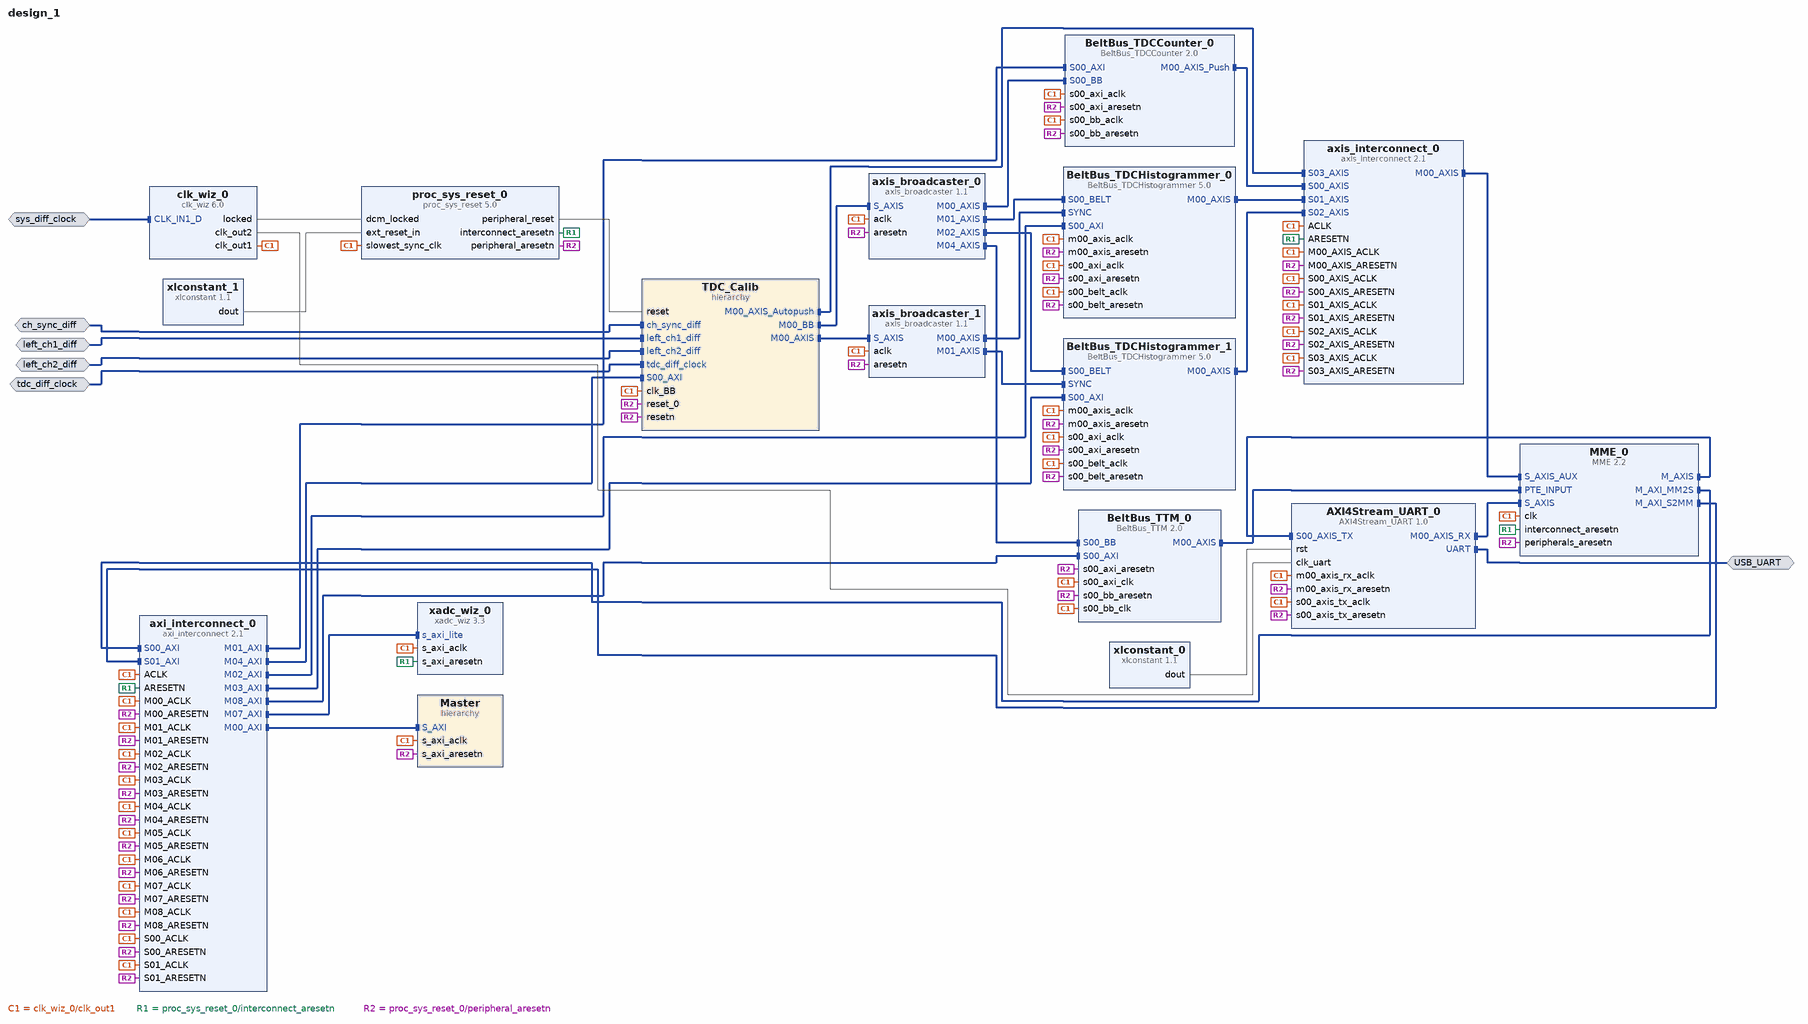
[diagram p0: block diagram of the top level]
# Vivado block design design_1, xc7k325tfbg676-2, Vivado 2020.2
create_bd_design design_1

create_bd_intf_port -mode Master -vlnv xilinx.com:interface:uart_rtl:1.0 USB_UART
create_bd_intf_port -mode Slave -vlnv DigiLAB:if:diff_ch_tdc_rtl:1.1 ch_sync_diff
create_bd_intf_port -mode Slave -vlnv DigiLAB:if:diff_ch_tdc_rtl:1.1 left_ch1_diff
create_bd_intf_port -mode Slave -vlnv DigiLAB:if:diff_ch_tdc_rtl:1.1 left_ch2_diff
create_bd_intf_port -mode Slave -vlnv xilinx.com:interface:diff_clock_rtl:1.0 sys_diff_clock
set_property -dict {CONFIG.FREQ_HZ 100000000} [get_bd_intf_ports sys_diff_clock]
create_bd_intf_port -mode Slave -vlnv xilinx.com:interface:diff_clock_rtl:1.0 tdc_diff_clock
set_property -dict {CONFIG.FREQ_HZ 156250000} [get_bd_intf_ports tdc_diff_clock]

create_bd_cell -type ip -vlnv TimeEngineers:ip:AXI4Stream_UART:1.0 AXI4Stream_UART_0
set_property -dict [list \
  CONFIG.UART_BAUD_RATE 2000000 \
  CONFIG.UART_BOARD_INTERFACE USB_UART \
  CONFIG.USE_BOARD_FLOW true \
] [get_bd_cells AXI4Stream_UART_0]
create_bd_cell -type ip -vlnv DigiLAB:ip:BeltBus_TDCCounter:2.0 BeltBus_TDCCounter_0
set_property -dict {CONFIG.NUM_CH 3} [get_bd_cells BeltBus_TDCCounter_0]
create_bd_cell -type ip -vlnv DigiLAB:ip:BeltBus_TDCHistogrammer:5.0 BeltBus_TDCHistogrammer_0
set_property -dict [list \
  CONFIG.BIN_ADDR_WIDTH 13 \
  CONFIG.BIN_DATA_WIDTH 27 \
  CONFIG.BIT_OVERFLOW 16 \
  CONFIG.NUM_CH 3 \
] [get_bd_cells BeltBus_TDCHistogrammer_0]
create_bd_cell -type ip -vlnv DigiLAB:ip:BeltBus_TDCHistogrammer:5.0 BeltBus_TDCHistogrammer_1
set_property -dict [list \
  CONFIG.BIN_ADDR_WIDTH 13 \
  CONFIG.BIN_DATA_WIDTH 27 \
  CONFIG.BIT_OVERFLOW 16 \
  CONFIG.NUM_CH 3 \
] [get_bd_cells BeltBus_TDCHistogrammer_1]
create_bd_cell -type ip -vlnv DigiLAB:ip:BeltBus_TTM:2.0 BeltBus_TTM_0
set_property -dict [list \
  CONFIG.CUSTOM_TRESHOLD false \
  CONFIG.INS_TIMEOUT_CYCLES 100000000 \
  CONFIG.TAIL_FIFO_DEPTH 16384 \
  CONFIG.TLAST_GEN_TIMEOUT_CYCLES 30 \
] [get_bd_cells BeltBus_TTM_0]
create_bd_cell -type ip -vlnv DigiLAB:hier:MME:2.2 MME_0
set_property -dict {CONFIG.MAX_PACKET_LENGTH_PACKETIZER 131072 CONFIG.PTE_AUXILIARY_PORTS true} [get_bd_cells MME_0]
create_bd_cell -type hier Master
create_bd_cell -type hier TDC_Calib
create_bd_cell -type ip -vlnv xilinx.com:ip:axi_interconnect:2.1 axi_interconnect_0
set_property -dict {CONFIG.NUM_MI 9 CONFIG.NUM_SI 2} [get_bd_cells axi_interconnect_0]
create_bd_cell -type ip -vlnv xilinx.com:ip:axis_broadcaster:1.1 axis_broadcaster_0
set_property -dict [list \
  CONFIG.HAS_TREADY 0 \
  CONFIG.M00_TDATA_REMAP {tdata[31:0]} \
  CONFIG.M01_TDATA_REMAP {tdata[31:0]} \
  CONFIG.M02_TDATA_REMAP {tdata[31:0]} \
  CONFIG.M03_TDATA_REMAP {tdata[31:0]} \
  CONFIG.M04_TDATA_REMAP {tdata[31:0]} \
  CONFIG.M_TDATA_NUM_BYTES 4 \
  CONFIG.NUM_MI 5 \
  CONFIG.S_TDATA_NUM_BYTES 4 \
] [get_bd_cells axis_broadcaster_0]
create_bd_cell -type ip -vlnv xilinx.com:ip:axis_broadcaster:1.1 axis_broadcaster_1
set_property -dict [list \
  CONFIG.HAS_TREADY 0 \
  CONFIG.M00_TDATA_REMAP {tdata[39:0]} \
  CONFIG.M01_TDATA_REMAP {tdata[39:0]} \
  CONFIG.M02_TDATA_REMAP {tdata[31:0]} \
  CONFIG.M03_TDATA_REMAP {tdata[31:0]} \
  CONFIG.M_TDATA_NUM_BYTES 5 \
  CONFIG.NUM_MI 2 \
  CONFIG.S_TDATA_NUM_BYTES 5 \
] [get_bd_cells axis_broadcaster_1]
create_bd_cell -type ip -vlnv xilinx.com:ip:axis_interconnect:2.1 axis_interconnect_0
set_property -dict {CONFIG.NUM_MI 1 CONFIG.NUM_SI 4} [get_bd_cells axis_interconnect_0]
create_bd_cell -type ip -vlnv xilinx.com:ip:clk_wiz:6.0 clk_wiz_0
set_property -dict [list \
  CONFIG.CLKOUT1_JITTER 144.719 \
  CONFIG.CLKOUT1_PHASE_ERROR 114.212 \
  CONFIG.CLKOUT2_JITTER 131.841 \
  CONFIG.CLKOUT2_PHASE_ERROR 114.212 \
  CONFIG.CLKOUT2_REQUESTED_OUT_FREQ 160.000 \
  CONFIG.CLKOUT2_USED true \
  CONFIG.CLK_IN1_BOARD_INTERFACE sys_diff_clock \
  CONFIG.MMCM_CLKFBOUT_MULT_F 8.000 \
  CONFIG.MMCM_CLKOUT0_DIVIDE_F 8.000 \
  CONFIG.MMCM_CLKOUT1_DIVIDE 5 \
  CONFIG.NUM_OUT_CLKS 2 \
  CONFIG.USE_BOARD_FLOW true \
  CONFIG.USE_RESET false \
] [get_bd_cells clk_wiz_0]
create_bd_cell -type ip -vlnv xilinx.com:ip:proc_sys_reset:5.0 proc_sys_reset_0
create_bd_cell -type ip -vlnv xilinx.com:ip:xadc_wiz:3.3 xadc_wiz_0
set_property -dict [list \
  CONFIG.ADC_CONVERSION_RATE 39 \
  CONFIG.CHANNEL_AVERAGING 256 \
  CONFIG.CHANNEL_ENABLE_TEMPERATURE true \
  CONFIG.CHANNEL_ENABLE_VP_VN false \
  CONFIG.DCLK_FREQUENCY 8 \
  CONFIG.EXTERNAL_MUX_CHANNEL VP_VN \
  CONFIG.OT_ALARM false \
  CONFIG.SEQUENCER_MODE Continuous \
  CONFIG.SINGLE_CHANNEL_SELECTION TEMPERATURE \
  CONFIG.USER_TEMP_ALARM false \
  CONFIG.VCCAUX_ALARM false \
  CONFIG.VCCINT_ALARM false \
  CONFIG.XADC_STARUP_SELECTION channel_sequencer \
] [get_bd_cells xadc_wiz_0]
create_bd_cell -type ip -vlnv xilinx.com:ip:xlconstant:1.1 xlconstant_0
set_property -dict {CONFIG.CONST_VAL 0} [get_bd_cells xlconstant_0]
create_bd_cell -type ip -vlnv xilinx.com:ip:xlconstant:1.1 xlconstant_1
set_property -dict {CONFIG.CONST_VAL 1} [get_bd_cells xlconstant_1]

# ---- hierarchy /Master ----
current_bd_instance /Master
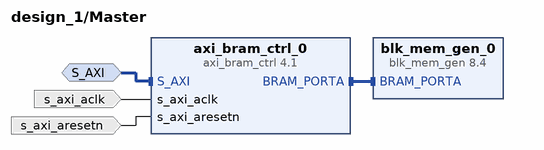
[diagram p1: block diagram inside /Master]
create_bd_intf_pin -mode Slave -vlnv xilinx.com:interface:aximm_rtl:1.0 S_AXI
create_bd_pin -dir I -type clk s_axi_aclk
create_bd_pin -dir I -type rst s_axi_aresetn

create_bd_cell -type ip -vlnv xilinx.com:ip:axi_bram_ctrl:4.1 axi_bram_ctrl_0
set_property -dict {CONFIG.SINGLE_PORT_BRAM 1 CONFIG.SUPPORTS_NARROW_BURST 0} [get_bd_cells axi_bram_ctrl_0]
create_bd_cell -type ip -vlnv xilinx.com:ip:blk_mem_gen:8.4 blk_mem_gen_0
set_property -dict [list \
  CONFIG.Coe_File ../../../../../../../../../master_v70.coe \
  CONFIG.EN_SAFETY_CKT true \
  CONFIG.Enable_32bit_Address true \
  CONFIG.Load_Init_File true \
  CONFIG.Memory_Type Single_Port_ROM \
  CONFIG.Port_A_Write_Rate 0 \
  CONFIG.Register_PortA_Output_of_Memory_Primitives false \
  CONFIG.Use_RSTA_Pin true \
  CONFIG.use_bram_block BRAM_Controller \
] [get_bd_cells blk_mem_gen_0]

# ---- hierarchy /TDC_Calib ----
current_bd_instance /TDC_Calib
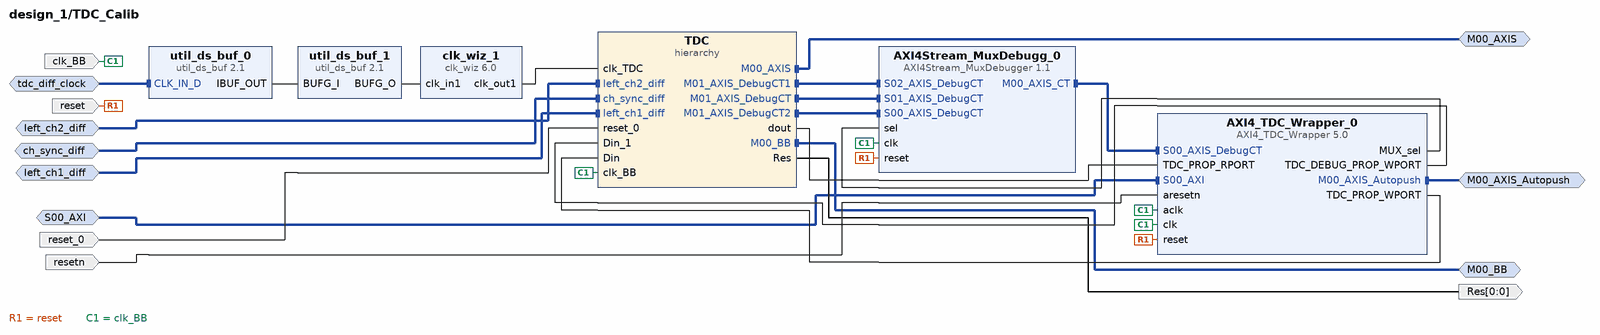
[diagram p2: block diagram inside /TDC_Calib]
create_bd_intf_pin -mode Master -vlnv xilinx.com:interface:axis_rtl:1.0 M00_AXIS
create_bd_intf_pin -mode Master -vlnv xilinx.com:interface:axis_rtl:1.0 M00_AXIS_Autopush
create_bd_intf_pin -mode Master -vlnv xilinx.com:interface:axis_rtl:1.0 M00_BB
create_bd_intf_pin -mode Slave -vlnv xilinx.com:interface:aximm_rtl:1.0 S00_AXI
create_bd_intf_pin -mode Slave -vlnv DigiLAB:if:diff_ch_tdc_rtl:1.1 ch_sync_diff
create_bd_intf_pin -mode Slave -vlnv DigiLAB:if:diff_ch_tdc_rtl:1.1 left_ch1_diff
create_bd_intf_pin -mode Slave -vlnv DigiLAB:if:diff_ch_tdc_rtl:1.1 left_ch2_diff
create_bd_intf_pin -mode Slave -vlnv xilinx.com:interface:diff_clock_rtl:1.0 tdc_diff_clock
create_bd_pin -dir O -from 0 -to 0 Res
create_bd_pin -dir I -type clk clk_BB
create_bd_pin -dir I -type rst reset
create_bd_pin -dir I -type rst reset_0
create_bd_pin -dir I -type rst resetn

create_bd_cell -type ip -vlnv DigiLAB:ip:AXI4Stream_MuxDebugger:1.1 AXI4Stream_MuxDebugg_0
set_property -dict {CONFIG.DEBUG_MODE_CC false CONFIG.NUM_CHANNEL 3} [get_bd_cells AXI4Stream_MuxDebugg_0]
create_bd_cell -type ip -vlnv DigiLAB:ip:AXI4_TDC_Wrapper:5.0 AXI4_TDC_Wrapper_0
set_property -dict [list \
  CONFIG.BIT_CALIBRATION 24 \
  CONFIG.BIT_RESOLUTION 11 \
  CONFIG.BIT_UNCALIBRATED 11 \
  CONFIG.C_S00_AXI_ADDR_ABS 0x44A40000 \
  CONFIG.DEBUG_MODE_CC false \
  CONFIG.DEF_CH_STRETCHERLENGTH 6 \
  CONFIG.DEF_SYNC_STRETCHERLENGTH 1 \
  CONFIG.PW_StretcherLength 3 \
  CONFIG.TDC_CH_RPORT_WIDTH 65 \
  CONFIG.TDC_ENABLE_DEBUG_PORTS true \
] [get_bd_cells AXI4_TDC_Wrapper_0]
create_bd_cell -type hier TDC
create_bd_cell -type ip -vlnv xilinx.com:ip:clk_wiz:6.0 clk_wiz_1
set_property -dict [list \
  CONFIG.CLKIN1_JITTER_PS 64.0 \
  CONFIG.CLKOUT1_JITTER 119.965 \
  CONFIG.CLKOUT1_PHASE_ERROR 158.075 \
  CONFIG.CLKOUT1_REQUESTED_OUT_FREQ 416.66667 \
  CONFIG.MMCM_CLKFBOUT_MULT_F 19.000 \
  CONFIG.MMCM_CLKIN1_PERIOD 6.400 \
  CONFIG.MMCM_CLKIN2_PERIOD 10.000 \
  CONFIG.MMCM_CLKOUT0_DIVIDE_F 2.375 \
  CONFIG.MMCM_DIVCLK_DIVIDE 3 \
  CONFIG.PRIM_IN_FREQ 156.25 \
  CONFIG.USE_RESET false \
] [get_bd_cells clk_wiz_1]
create_bd_cell -type ip -vlnv xilinx.com:ip:util_ds_buf:2.1 util_ds_buf_0
set_property -dict {CONFIG.DIFF_CLK_IN_BOARD_INTERFACE tdc_diff_clock} [get_bd_cells util_ds_buf_0]
create_bd_cell -type ip -vlnv xilinx.com:ip:util_ds_buf:2.1 util_ds_buf_1
set_property -dict {CONFIG.C_BUF_TYPE BUFG CONFIG.DIFF_CLK_IN_BOARD_INTERFACE Custom} [get_bd_cells util_ds_buf_1]

# ---- hierarchy /TDC_Calib/TDC ----
current_bd_instance /TDC_Calib/TDC
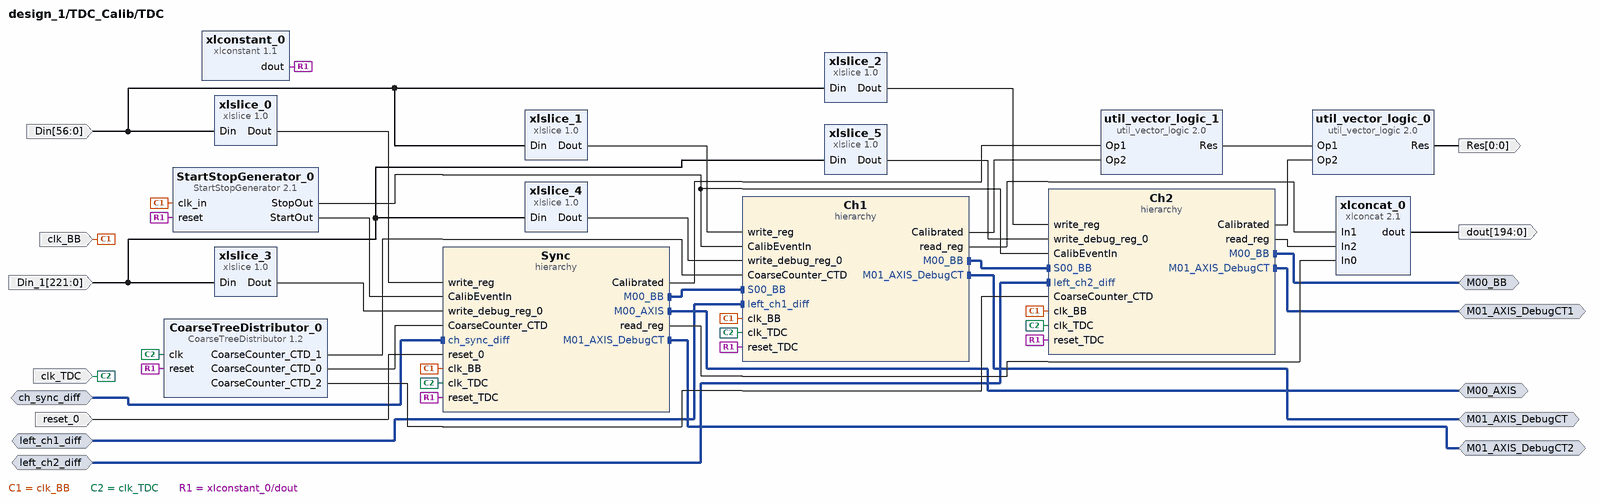
[diagram p3: block diagram inside /TDC_Calib/TDC]
create_bd_intf_pin -mode Master -vlnv xilinx.com:interface:axis_rtl:1.0 M00_AXIS
create_bd_intf_pin -mode Master -vlnv xilinx.com:interface:axis_rtl:1.0 M00_BB
create_bd_intf_pin -mode Master -vlnv xilinx.com:interface:axis_rtl:1.0 M01_AXIS_DebugCT
create_bd_intf_pin -mode Master -vlnv xilinx.com:interface:axis_rtl:1.0 M01_AXIS_DebugCT1
create_bd_intf_pin -mode Master -vlnv xilinx.com:interface:axis_rtl:1.0 M01_AXIS_DebugCT2
create_bd_intf_pin -mode Slave -vlnv DigiLAB:if:diff_ch_tdc_rtl:1.1 ch_sync_diff
create_bd_intf_pin -mode Slave -vlnv DigiLAB:if:diff_ch_tdc_rtl:1.1 left_ch1_diff
create_bd_intf_pin -mode Slave -vlnv DigiLAB:if:diff_ch_tdc_rtl:1.1 left_ch2_diff
create_bd_pin -dir I -from 56 -to 0 Din
create_bd_pin -dir I -from 221 -to 0 Din_1
create_bd_pin -dir O -from 0 -to 0 Res
create_bd_pin -dir I -type clk clk_BB
create_bd_pin -dir I -type clk clk_TDC
create_bd_pin -dir O -from 194 -to 0 dout
create_bd_pin -dir I -type rst reset_0

create_bd_cell -type hier Ch1
create_bd_cell -type hier Ch2
create_bd_cell -type ip -vlnv DigiLAB:ip:CoarseTreeDistributor:1.2 CoarseTreeDistributor_0
set_property -dict {CONFIG.NUMBER_OF_OUTPUT 3} [get_bd_cells CoarseTreeDistributor_0]
create_bd_cell -type ip -vlnv DigiLAB:ip:StartStopGenerator:2.1 StartStopGenerator_0
set_property -dict {CONFIG.CLK_SELECT EXTERNAL CONFIG.HALF_DIVIDER 5 CONFIG.TUNING_MODE false} [get_bd_cells StartStopGenerator_0]
create_bd_cell -type hier Sync
create_bd_cell -type ip -vlnv xilinx.com:ip:util_vector_logic:2.0 util_vector_logic_0
set_property -dict {CONFIG.C_SIZE 1} [get_bd_cells util_vector_logic_0]
create_bd_cell -type ip -vlnv xilinx.com:ip:util_vector_logic:2.0 util_vector_logic_1
set_property -dict {CONFIG.C_SIZE 1} [get_bd_cells util_vector_logic_1]
create_bd_cell -type ip -vlnv xilinx.com:ip:xlconcat:2.1 xlconcat_0
set_property -dict {CONFIG.IN0_WIDTH 65 CONFIG.IN1_WIDTH 65 CONFIG.IN2_WIDTH 65 CONFIG.NUM_PORTS 3} [get_bd_cells xlconcat_0]
create_bd_cell -type ip -vlnv xilinx.com:ip:xlconstant:1.1 xlconstant_0
set_property -dict {CONFIG.CONST_VAL 0} [get_bd_cells xlconstant_0]
create_bd_cell -type ip -vlnv xilinx.com:ip:xlslice:1.0 xlslice_0
set_property -dict {CONFIG.DIN_FROM 18 CONFIG.DIN_WIDTH 57 CONFIG.DOUT_WIDTH 19} [get_bd_cells xlslice_0]
create_bd_cell -type ip -vlnv xilinx.com:ip:xlslice:1.0 xlslice_1
set_property -dict {CONFIG.DIN_FROM 37 CONFIG.DIN_TO 19 CONFIG.DIN_WIDTH 57 CONFIG.DOUT_WIDTH 19} [get_bd_cells xlslice_1]
create_bd_cell -type ip -vlnv xilinx.com:ip:xlslice:1.0 xlslice_2
set_property -dict {CONFIG.DIN_FROM 56 CONFIG.DIN_TO 38 CONFIG.DIN_WIDTH 57 CONFIG.DOUT_WIDTH 19} [get_bd_cells xlslice_2]
create_bd_cell -type ip -vlnv xilinx.com:ip:xlslice:1.0 xlslice_3
set_property -dict {CONFIG.DIN_FROM 73 CONFIG.DIN_WIDTH 222 CONFIG.DOUT_WIDTH 74} [get_bd_cells xlslice_3]
create_bd_cell -type ip -vlnv xilinx.com:ip:xlslice:1.0 xlslice_4
set_property -dict {CONFIG.DIN_FROM 147 CONFIG.DIN_TO 74 CONFIG.DIN_WIDTH 222 CONFIG.DOUT_WIDTH 74} [get_bd_cells xlslice_4]
create_bd_cell -type ip -vlnv xilinx.com:ip:xlslice:1.0 xlslice_5
set_property -dict {CONFIG.DIN_FROM 221 CONFIG.DIN_TO 148 CONFIG.DIN_WIDTH 222 CONFIG.DOUT_WIDTH 74} [get_bd_cells xlslice_5]

# ---- hierarchy /TDC_Calib/TDC/Ch1 ----
current_bd_instance /TDC_Calib/TDC/Ch1
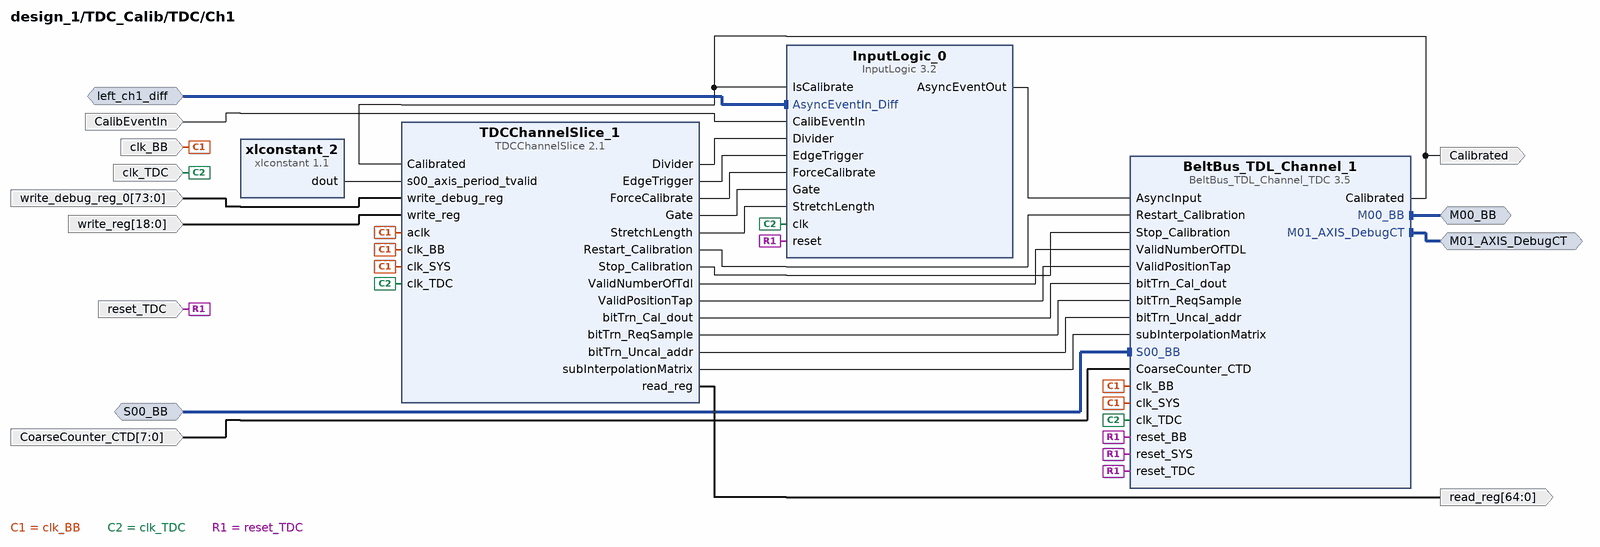
[diagram p4: block diagram inside /TDC_Calib/TDC/Ch1]
create_bd_intf_pin -mode Master -vlnv xilinx.com:interface:axis_rtl:1.0 M00_BB
create_bd_intf_pin -mode Master -vlnv xilinx.com:interface:axis_rtl:1.0 M01_AXIS_DebugCT
create_bd_intf_pin -mode Slave -vlnv xilinx.com:interface:axis_rtl:1.0 S00_BB
create_bd_intf_pin -mode Slave -vlnv DigiLAB:if:diff_ch_tdc_rtl:1.1 left_ch1_diff
create_bd_pin -dir I -type data CalibEventIn
create_bd_pin -dir O -type data Calibrated
create_bd_pin -dir I -from 7 -to 0 CoarseCounter_CTD
create_bd_pin -dir I -type clk clk_BB
create_bd_pin -dir I -type clk clk_TDC
create_bd_pin -dir O -from 64 -to 0 -type data read_reg
create_bd_pin -dir I -type rst reset_TDC
create_bd_pin -dir I -from 73 -to 0 -type data write_debug_reg_0
create_bd_pin -dir I -from 18 -to 0 -type data write_reg

create_bd_cell -type ip -vlnv DigiLAB:hier:BeltBus_TDL_Channel_TDC:3.5 BeltBus_TDL_Channel_1
set_property -dict [list \
  CONFIG.BIT_SMP_PRE_TDL 128 \
  CONFIG.BIT_SMP_TDL 512 \
  CONFIG.BIT_UNCALIBRATED 11 \
  CONFIG.BUFFERING_STAGE false \
  CONFIG.CEC_VS_CTD_COUNTER CTD \
  CONFIG.DEBUG_MODE true \
  CONFIG.DEBUG_MODE_CT true \
  CONFIG.DEBUG_PORT_DECODER true \
  CONFIG.MAX_VALID_TAP_POS 511 \
  CONFIG.MIN_VALID_TAP_POS -128 \
  CONFIG.NUMBER_OF_TDL 4 \
  CONFIG.NUM_CH 1 \
  CONFIG.NUM_NODE 1 \
  CONFIG.NUM_TAP_PRE_TDL 128 \
  CONFIG.NUM_TAP_TDL 512 \
  CONFIG.STEP_VALID_TAP_POS 16 \
  CONFIG.VALID_POSITION_TAP_INIT 0 \
] [get_bd_cells BeltBus_TDL_Channel_1]
create_bd_cell -type ip -vlnv DigiLAB:ip:InputLogic:3.2 InputLogic_0
set_property -dict [list \
  CONFIG.BIT_DIVIDER 4 \
  CONFIG.BIT_STRETCH_LENGTH 3 \
  CONFIG.INPUT_DIFF_CH_TDC_BOARD_INTERFACE left_ch1_diff \
  CONFIG.STRETCH_LENGTH_INIT 6 \
  CONFIG.TUNING_MODE true \
] [get_bd_cells InputLogic_0]
create_bd_cell -type ip -vlnv DigiLAB:ip:TDCChannelSlice:2.1 TDCChannelSlice_1
set_property -dict {CONFIG.BIT_DIVIDER 4 CONFIG.TDC_ENABLE_DEBUG_PORTS true} [get_bd_cells TDCChannelSlice_1]
create_bd_cell -type ip -vlnv xilinx.com:ip:xlconstant:1.1 xlconstant_2
set_property -dict {CONFIG.CONST_VAL 0} [get_bd_cells xlconstant_2]

# ---- hierarchy /TDC_Calib/TDC/Ch2 ----
current_bd_instance /TDC_Calib/TDC/Ch2
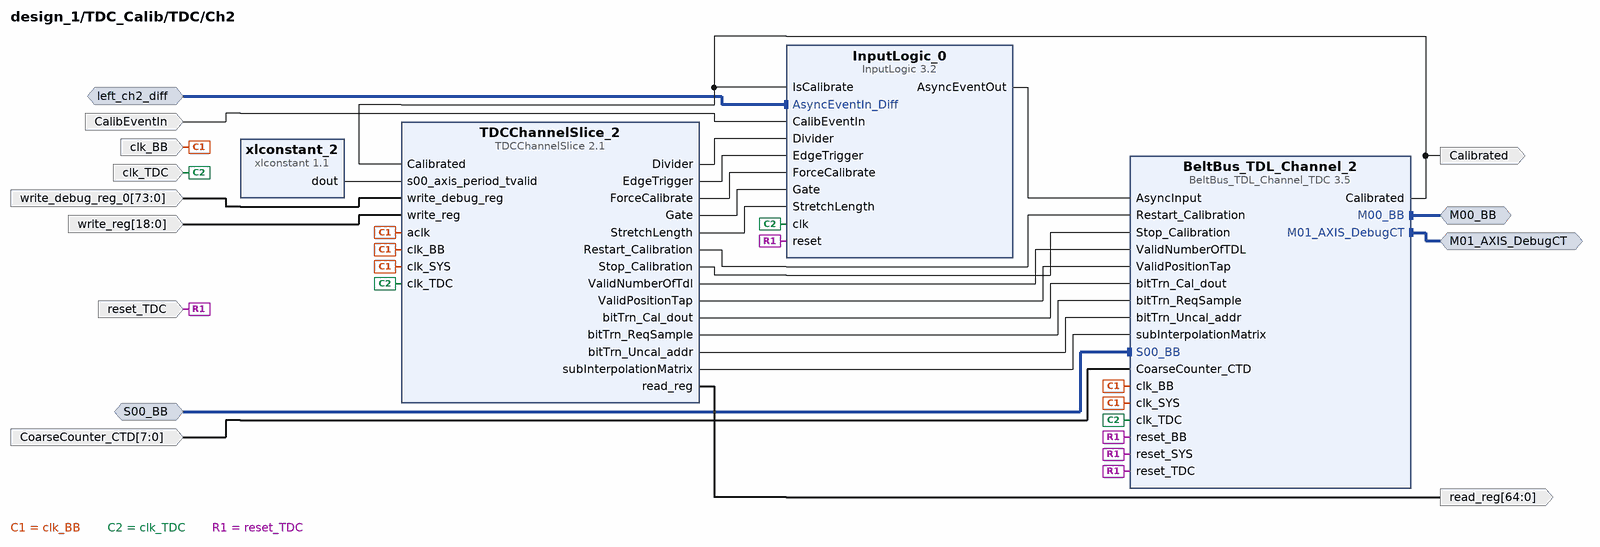
[diagram p5: block diagram inside /TDC_Calib/TDC/Ch2]
create_bd_intf_pin -mode Master -vlnv xilinx.com:interface:axis_rtl:1.0 M00_BB
create_bd_intf_pin -mode Master -vlnv xilinx.com:interface:axis_rtl:1.0 M01_AXIS_DebugCT
create_bd_intf_pin -mode Slave -vlnv xilinx.com:interface:axis_rtl:1.0 S00_BB
create_bd_intf_pin -mode Slave -vlnv DigiLAB:if:diff_ch_tdc_rtl:1.1 left_ch2_diff
create_bd_pin -dir I -type data CalibEventIn
create_bd_pin -dir O -type data Calibrated
create_bd_pin -dir I -from 7 -to 0 CoarseCounter_CTD
create_bd_pin -dir I -type clk clk_BB
create_bd_pin -dir I -type clk clk_TDC
create_bd_pin -dir O -from 64 -to 0 -type data read_reg
create_bd_pin -dir I -type rst reset_TDC
create_bd_pin -dir I -from 73 -to 0 -type data write_debug_reg_0
create_bd_pin -dir I -from 18 -to 0 -type data write_reg

create_bd_cell -type ip -vlnv DigiLAB:hier:BeltBus_TDL_Channel_TDC:3.5 BeltBus_TDL_Channel_2
set_property -dict [list \
  CONFIG.BIT_SMP_PRE_TDL 128 \
  CONFIG.BIT_SMP_TDL 512 \
  CONFIG.BIT_UNCALIBRATED 11 \
  CONFIG.BUFFERING_STAGE false \
  CONFIG.CEC_VS_CTD_COUNTER CTD \
  CONFIG.DEBUG_MODE true \
  CONFIG.DEBUG_MODE_CT true \
  CONFIG.DEBUG_PORT_DECODER true \
  CONFIG.MAX_VALID_TAP_POS 511 \
  CONFIG.MIN_VALID_TAP_POS -128 \
  CONFIG.NUMBER_OF_TDL 4 \
  CONFIG.NUM_CH 2 \
  CONFIG.NUM_NODE 2 \
  CONFIG.NUM_TAP_PRE_TDL 128 \
  CONFIG.NUM_TAP_TDL 512 \
  CONFIG.STEP_VALID_TAP_POS 16 \
  CONFIG.VALID_POSITION_TAP_INIT 0 \
] [get_bd_cells BeltBus_TDL_Channel_2]
create_bd_cell -type ip -vlnv DigiLAB:ip:InputLogic:3.2 InputLogic_0
set_property -dict [list \
  CONFIG.BIT_DIVIDER 4 \
  CONFIG.BIT_STRETCH_LENGTH 3 \
  CONFIG.INPUT_DIFF_CH_TDC_BOARD_INTERFACE left_ch2_diff \
  CONFIG.INVERT_BUFFER_POLARITY true \
  CONFIG.STRETCH_LENGTH_INIT 6 \
  CONFIG.TUNING_MODE true \
] [get_bd_cells InputLogic_0]
create_bd_cell -type ip -vlnv DigiLAB:ip:TDCChannelSlice:2.1 TDCChannelSlice_2
set_property -dict {CONFIG.BIT_DIVIDER 4 CONFIG.TDC_ENABLE_DEBUG_PORTS true} [get_bd_cells TDCChannelSlice_2]
create_bd_cell -type ip -vlnv xilinx.com:ip:xlconstant:1.1 xlconstant_2
set_property -dict {CONFIG.CONST_VAL 0} [get_bd_cells xlconstant_2]

# ---- hierarchy /TDC_Calib/TDC/Sync ----
current_bd_instance /TDC_Calib/TDC/Sync
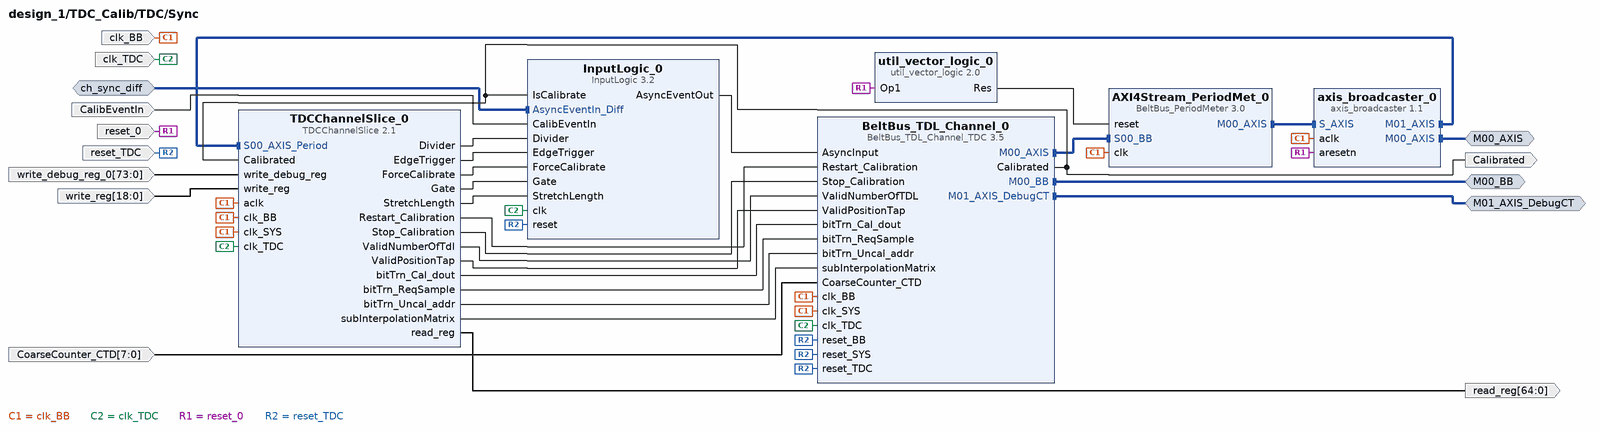
[diagram p6: block diagram inside /TDC_Calib/TDC/Sync]
create_bd_intf_pin -mode Master -vlnv xilinx.com:interface:axis_rtl:1.0 M00_AXIS
create_bd_intf_pin -mode Master -vlnv xilinx.com:interface:axis_rtl:1.0 M00_BB
create_bd_intf_pin -mode Master -vlnv xilinx.com:interface:axis_rtl:1.0 M01_AXIS_DebugCT
create_bd_intf_pin -mode Slave -vlnv DigiLAB:if:diff_ch_tdc_rtl:1.1 ch_sync_diff
create_bd_pin -dir I -type data CalibEventIn
create_bd_pin -dir O -type data Calibrated
create_bd_pin -dir I -from 7 -to 0 CoarseCounter_CTD
create_bd_pin -dir I -type clk clk_BB
create_bd_pin -dir I -type clk clk_TDC
create_bd_pin -dir O -from 64 -to 0 -type data read_reg
create_bd_pin -dir I -type rst reset_0
create_bd_pin -dir I -type rst reset_TDC
create_bd_pin -dir I -from 73 -to 0 -type data write_debug_reg_0
create_bd_pin -dir I -from 18 -to 0 -type data write_reg

create_bd_cell -type ip -vlnv DigiLAB:ip:BeltBus_PeriodMeter:3.0 AXI4Stream_PeriodMet_0
set_property -dict {CONFIG.BIT_COARSE 8 CONFIG.BIT_OVERFLOW 16} [get_bd_cells AXI4Stream_PeriodMet_0]
create_bd_cell -type ip -vlnv DigiLAB:hier:BeltBus_TDL_Channel_TDC:3.5 BeltBus_TDL_Channel_0
set_property -dict [list \
  CONFIG.BIT_SMP_PRE_TDL 128 \
  CONFIG.BIT_SMP_TDL 512 \
  CONFIG.BIT_UNCALIBRATED 11 \
  CONFIG.BUFFERING_STAGE false \
  CONFIG.CEC_VS_CTD_COUNTER CTD \
  CONFIG.DEBUG_MODE true \
  CONFIG.DEBUG_MODE_CT true \
  CONFIG.DEBUG_PORT_DECODER true \
  CONFIG.MAX_VALID_TAP_POS 511 \
  CONFIG.MIN_VALID_TAP_POS -128 \
  CONFIG.NUMBER_OF_TDL 4 \
  CONFIG.NUM_TAP_PRE_TDL 128 \
  CONFIG.NUM_TAP_TDL 512 \
  CONFIG.PASS_THROUGH Both \
  CONFIG.STEP_VALID_TAP_POS 16 \
  CONFIG.VALID_POSITION_TAP_INIT 0 \
] [get_bd_cells BeltBus_TDL_Channel_0]
create_bd_cell -type ip -vlnv DigiLAB:ip:InputLogic:3.2 InputLogic_0
set_property -dict [list \
  CONFIG.BIT_DIVIDER 4 \
  CONFIG.BIT_STRETCH_LENGTH 3 \
  CONFIG.DIVIDER_INIT 15 \
  CONFIG.INPUT_DIFF_CH_TDC_BOARD_INTERFACE ch_sync_diff \
  CONFIG.STRETCH_LENGTH_INIT 6 \
  CONFIG.TUNING_MODE true \
] [get_bd_cells InputLogic_0]
create_bd_cell -type ip -vlnv DigiLAB:ip:TDCChannelSlice:2.1 TDCChannelSlice_0
set_property -dict [list \
  CONFIG.BIT_DIVIDER 4 \
  CONFIG.BIT_OVERFLOW 16 \
  CONFIG.TDC_ENABLE_DEBUG_PORTS true \
] [get_bd_cells TDCChannelSlice_0]
create_bd_cell -type ip -vlnv xilinx.com:ip:axis_broadcaster:1.1 axis_broadcaster_0
set_property -dict [list \
  CONFIG.HAS_TREADY 0 \
  CONFIG.M00_TDATA_REMAP {tdata[39:0]} \
  CONFIG.M01_TDATA_REMAP {tdata[39:0]} \
  CONFIG.M_TDATA_NUM_BYTES 5 \
  CONFIG.S_TDATA_NUM_BYTES 5 \
] [get_bd_cells axis_broadcaster_0]
create_bd_cell -type ip -vlnv xilinx.com:ip:util_vector_logic:2.0 util_vector_logic_0
set_property -dict {CONFIG.C_OPERATION not CONFIG.C_SIZE 1} [get_bd_cells util_vector_logic_0]

# ---- connections ----

current_bd_instance /Master
connect_bd_intf_net -intf_net axi_interconnect_0_M00_AXI [get_bd_intf_pins S_AXI] [get_bd_intf_pins axi_bram_ctrl_0/S_AXI]
connect_bd_intf_net [get_bd_intf_pins axi_bram_ctrl_0/BRAM_PORTA] [get_bd_intf_pins blk_mem_gen_0/BRAM_PORTA]
connect_bd_net [get_bd_pins s_axi_aclk] [get_bd_pins axi_bram_ctrl_0/s_axi_aclk]
connect_bd_net [get_bd_pins s_axi_aresetn] [get_bd_pins axi_bram_ctrl_0/s_axi_aresetn]

current_bd_instance /TDC_Calib
connect_bd_intf_net [get_bd_intf_pins left_ch2_diff] [get_bd_intf_pins TDC/left_ch2_diff]
connect_bd_intf_net [get_bd_intf_pins M00_AXIS] [get_bd_intf_pins TDC/M00_AXIS]
connect_bd_intf_net [get_bd_intf_pins AXI4Stream_MuxDebugg_0/S02_AXIS_DebugCT] [get_bd_intf_pins TDC/M01_AXIS_DebugCT1]
connect_bd_intf_net [get_bd_intf_pins M00_BB] [get_bd_intf_pins TDC/M00_BB]
connect_bd_intf_net [get_bd_intf_pins AXI4Stream_MuxDebugg_0/S01_AXIS_DebugCT] [get_bd_intf_pins TDC/M01_AXIS_DebugCT]
connect_bd_intf_net [get_bd_intf_pins ch_sync_diff] [get_bd_intf_pins TDC/ch_sync_diff]
connect_bd_intf_net [get_bd_intf_pins M00_AXIS_Autopush] [get_bd_intf_pins AXI4_TDC_Wrapper_0/M00_AXIS_Autopush]
connect_bd_intf_net [get_bd_intf_pins AXI4Stream_MuxDebugg_0/S00_AXIS_DebugCT] [get_bd_intf_pins TDC/M01_AXIS_DebugCT2]
connect_bd_intf_net [get_bd_intf_pins AXI4Stream_MuxDebugg_0/M00_AXIS_CT] [get_bd_intf_pins AXI4_TDC_Wrapper_0/S00_AXIS_DebugCT]
connect_bd_intf_net [get_bd_intf_pins left_ch1_diff] [get_bd_intf_pins TDC/left_ch1_diff]
connect_bd_intf_net [get_bd_intf_pins tdc_diff_clock] [get_bd_intf_pins util_ds_buf_0/CLK_IN_D]
connect_bd_intf_net [get_bd_intf_pins S00_AXI] [get_bd_intf_pins AXI4_TDC_Wrapper_0/S00_AXI]
connect_bd_net [get_bd_pins AXI4_TDC_Wrapper_0/MUX_sel] [get_bd_pins AXI4Stream_MuxDebugg_0/sel]
connect_bd_net [get_bd_pins AXI4_TDC_Wrapper_0/TDC_DEBUG_PROP_WPORT] [get_bd_pins TDC/Din_1]
connect_bd_net [get_bd_pins AXI4_TDC_Wrapper_0/TDC_PROP_WPORT] [get_bd_pins TDC/Din]
connect_bd_net [get_bd_pins reset] [get_bd_pins AXI4Stream_MuxDebugg_0/reset] [get_bd_pins AXI4_TDC_Wrapper_0/reset]
connect_bd_net [get_bd_pins TDC/Res] [get_bd_pins Res]
connect_bd_net [get_bd_pins TDC/dout] [get_bd_pins AXI4_TDC_Wrapper_0/TDC_PROP_RPORT]
connect_bd_net -net clk_wiz_0_clk_out1 [get_bd_pins clk_BB] \
  [get_bd_pins AXI4Stream_MuxDebugg_0/clk] [get_bd_pins AXI4_TDC_Wrapper_0/aclk] [get_bd_pins AXI4_TDC_Wrapper_0/clk] \
  [get_bd_pins TDC/clk_BB]
connect_bd_net [get_bd_pins clk_wiz_1/clk_out1] [get_bd_pins TDC/clk_TDC]
connect_bd_net -net proc_sys_reset_0_peripheral_aresetn [get_bd_pins resetn] [get_bd_pins AXI4_TDC_Wrapper_0/aresetn]
connect_bd_net -net reset_0_1 [get_bd_pins reset_0] [get_bd_pins TDC/reset_0]
connect_bd_net [get_bd_pins util_ds_buf_0/IBUF_OUT] [get_bd_pins util_ds_buf_1/BUFG_I]
connect_bd_net [get_bd_pins util_ds_buf_1/BUFG_O] [get_bd_pins clk_wiz_1/clk_in1]

current_bd_instance /TDC_Calib/TDC
connect_bd_intf_net -intf_net BeltBus_TDL_Channel_2_M00_BB [get_bd_intf_pins M00_BB] [get_bd_intf_pins Ch2/M00_BB]
connect_bd_intf_net [get_bd_intf_pins ch_sync_diff] [get_bd_intf_pins Sync/ch_sync_diff]
connect_bd_intf_net -intf_net BeltBus_TDL_Channel_1_M00_BB [get_bd_intf_pins Ch1/M00_BB] [get_bd_intf_pins Ch2/S00_BB]
connect_bd_intf_net -intf_net BeltBus_TDL_Channel_1_M01_AXIS_DebugCT [get_bd_intf_pins M01_AXIS_DebugCT] [get_bd_intf_pins Ch1/M01_AXIS_DebugCT]
connect_bd_intf_net -intf_net BeltBus_TDL_Channel_2_M01_AXIS_DebugCT [get_bd_intf_pins M01_AXIS_DebugCT1] [get_bd_intf_pins Ch2/M01_AXIS_DebugCT]
connect_bd_intf_net [get_bd_intf_pins M00_AXIS] [get_bd_intf_pins Sync/M00_AXIS]
connect_bd_intf_net [get_bd_intf_pins left_ch1_diff] [get_bd_intf_pins Ch1/left_ch1_diff]
connect_bd_intf_net [get_bd_intf_pins left_ch2_diff] [get_bd_intf_pins Ch2/left_ch2_diff]
connect_bd_intf_net -intf_net BeltBus_TDL_Channel_0_M00_BB [get_bd_intf_pins Ch1/S00_BB] [get_bd_intf_pins Sync/M00_BB]
connect_bd_intf_net -intf_net BeltBus_TDL_Channel_0_M01_AXIS_DebugCT [get_bd_intf_pins M01_AXIS_DebugCT2] [get_bd_intf_pins Sync/M01_AXIS_DebugCT]
connect_bd_net -net BeltBus_TDL_Channel_TDC_0_Calibrated [get_bd_pins Sync/Calibrated] [get_bd_pins util_vector_logic_1/Op1]
connect_bd_net -net BeltBus_TDL_Channel_TDC_1_Calibrated [get_bd_pins Ch1/Calibrated] [get_bd_pins util_vector_logic_1/Op2]
connect_bd_net -net BeltBus_TDL_Channel_TDC_2_Calibrated [get_bd_pins Ch2/Calibrated] [get_bd_pins util_vector_logic_0/Op2]
connect_bd_net [get_bd_pins CoarseTreeDistributor_0/CoarseCounter_CTD_0] [get_bd_pins Sync/CoarseCounter_CTD]
connect_bd_net [get_bd_pins CoarseTreeDistributor_0/CoarseCounter_CTD_1] [get_bd_pins Ch1/CoarseCounter_CTD]
connect_bd_net [get_bd_pins CoarseTreeDistributor_0/CoarseCounter_CTD_2] [get_bd_pins Ch2/CoarseCounter_CTD]
connect_bd_net -net Din_1_1 [get_bd_pins Din_1] [get_bd_pins xlslice_3/Din] [get_bd_pins xlslice_4/Din] [get_bd_pins xlslice_5/Din]
connect_bd_net [get_bd_pins Din] [get_bd_pins xlslice_0/Din] [get_bd_pins xlslice_1/Din] [get_bd_pins xlslice_2/Din]
connect_bd_net [get_bd_pins StartStopGenerator_0/StartOut] [get_bd_pins Sync/CalibEventIn]
connect_bd_net [get_bd_pins StartStopGenerator_0/StopOut] [get_bd_pins Ch1/CalibEventIn] [get_bd_pins Ch2/CalibEventIn]
connect_bd_net [get_bd_pins Sync/read_reg] [get_bd_pins xlconcat_0/In0]
connect_bd_net -net TDCChannelSlice_1_read_reg [get_bd_pins Ch1/read_reg] [get_bd_pins xlconcat_0/In1]
connect_bd_net -net TDCChannelSlice_2_read_reg [get_bd_pins Ch2/read_reg] [get_bd_pins xlconcat_0/In2]
connect_bd_net [get_bd_pins clk_BB] \
  [get_bd_pins Ch1/clk_BB] [get_bd_pins Ch2/clk_BB] [get_bd_pins StartStopGenerator_0/clk_in] [get_bd_pins Sync/clk_BB]
connect_bd_net [get_bd_pins clk_TDC] \
  [get_bd_pins Ch1/clk_TDC] [get_bd_pins Ch2/clk_TDC] [get_bd_pins CoarseTreeDistributor_0/clk] [get_bd_pins Sync/clk_TDC]
connect_bd_net -net reset_0_1 [get_bd_pins reset_0] [get_bd_pins Sync/reset_0]
connect_bd_net -net reset_TDC_1 [get_bd_pins xlconstant_0/dout] \
  [get_bd_pins Ch1/reset_TDC] [get_bd_pins Ch2/reset_TDC] [get_bd_pins CoarseTreeDistributor_0/reset] \
  [get_bd_pins StartStopGenerator_0/reset] [get_bd_pins Sync/reset_TDC]
connect_bd_net [get_bd_pins util_vector_logic_0/Res] [get_bd_pins Res]
connect_bd_net [get_bd_pins util_vector_logic_1/Res] [get_bd_pins util_vector_logic_0/Op1]
connect_bd_net [get_bd_pins xlconcat_0/dout] [get_bd_pins dout]
connect_bd_net [get_bd_pins xlslice_0/Dout] [get_bd_pins Sync/write_reg]
connect_bd_net [get_bd_pins xlslice_1/Dout] [get_bd_pins Ch1/write_reg]
connect_bd_net [get_bd_pins xlslice_2/Dout] [get_bd_pins Ch2/write_reg]
connect_bd_net [get_bd_pins xlslice_3/Dout] [get_bd_pins Sync/write_debug_reg_0]
connect_bd_net [get_bd_pins xlslice_4/Dout] [get_bd_pins Ch1/write_debug_reg_0]
connect_bd_net [get_bd_pins xlslice_5/Dout] [get_bd_pins Ch2/write_debug_reg_0]

current_bd_instance /TDC_Calib/TDC/Ch1
connect_bd_intf_net [get_bd_intf_pins M00_BB] [get_bd_intf_pins BeltBus_TDL_Channel_1/M00_BB]
connect_bd_intf_net [get_bd_intf_pins left_ch1_diff] [get_bd_intf_pins InputLogic_0/AsyncEventIn_Diff]
connect_bd_intf_net [get_bd_intf_pins M01_AXIS_DebugCT] [get_bd_intf_pins BeltBus_TDL_Channel_1/M01_AXIS_DebugCT]
connect_bd_intf_net [get_bd_intf_pins S00_BB] [get_bd_intf_pins BeltBus_TDL_Channel_1/S00_BB]
connect_bd_net -net BeltBus_TDL_Channel_TDC_1_Calibrated [get_bd_pins BeltBus_TDL_Channel_1/Calibrated] \
  [get_bd_pins Calibrated] [get_bd_pins InputLogic_0/IsCalibrate] [get_bd_pins TDCChannelSlice_1/Calibrated]
connect_bd_net [get_bd_pins CalibEventIn] [get_bd_pins InputLogic_0/CalibEventIn]
connect_bd_net [get_bd_pins CoarseCounter_CTD] [get_bd_pins BeltBus_TDL_Channel_1/CoarseCounter_CTD]
connect_bd_net [get_bd_pins InputLogic_0/AsyncEventOut] [get_bd_pins BeltBus_TDL_Channel_1/AsyncInput]
connect_bd_net [get_bd_pins TDCChannelSlice_1/Divider] [get_bd_pins InputLogic_0/Divider]
connect_bd_net [get_bd_pins TDCChannelSlice_1/EdgeTrigger] [get_bd_pins InputLogic_0/EdgeTrigger]
connect_bd_net [get_bd_pins TDCChannelSlice_1/ForceCalibrate] [get_bd_pins InputLogic_0/ForceCalibrate]
connect_bd_net [get_bd_pins TDCChannelSlice_1/Gate] [get_bd_pins InputLogic_0/Gate]
connect_bd_net [get_bd_pins TDCChannelSlice_1/Restart_Calibration] [get_bd_pins BeltBus_TDL_Channel_1/Restart_Calibration]
connect_bd_net [get_bd_pins TDCChannelSlice_1/Stop_Calibration] [get_bd_pins BeltBus_TDL_Channel_1/Stop_Calibration]
connect_bd_net [get_bd_pins TDCChannelSlice_1/StretchLength] [get_bd_pins InputLogic_0/StretchLength]
connect_bd_net [get_bd_pins TDCChannelSlice_1/ValidNumberOfTdl] [get_bd_pins BeltBus_TDL_Channel_1/ValidNumberOfTDL]
connect_bd_net [get_bd_pins TDCChannelSlice_1/ValidPositionTap] [get_bd_pins BeltBus_TDL_Channel_1/ValidPositionTap]
connect_bd_net [get_bd_pins TDCChannelSlice_1/bitTrn_Cal_dout] [get_bd_pins BeltBus_TDL_Channel_1/bitTrn_Cal_dout]
connect_bd_net [get_bd_pins TDCChannelSlice_1/bitTrn_ReqSample] [get_bd_pins BeltBus_TDL_Channel_1/bitTrn_ReqSample]
connect_bd_net [get_bd_pins TDCChannelSlice_1/bitTrn_Uncal_addr] [get_bd_pins BeltBus_TDL_Channel_1/bitTrn_Uncal_addr]
connect_bd_net [get_bd_pins TDCChannelSlice_1/read_reg] [get_bd_pins read_reg]
connect_bd_net [get_bd_pins TDCChannelSlice_1/subInterpolationMatrix] [get_bd_pins BeltBus_TDL_Channel_1/subInterpolationMatrix]
connect_bd_net [get_bd_pins clk_BB] \
  [get_bd_pins BeltBus_TDL_Channel_1/clk_BB] [get_bd_pins BeltBus_TDL_Channel_1/clk_SYS] [get_bd_pins TDCChannelSlice_1/aclk] \
  [get_bd_pins TDCChannelSlice_1/clk_BB] [get_bd_pins TDCChannelSlice_1/clk_SYS]
connect_bd_net [get_bd_pins clk_TDC] \
  [get_bd_pins BeltBus_TDL_Channel_1/clk_TDC] [get_bd_pins InputLogic_0/clk] [get_bd_pins TDCChannelSlice_1/clk_TDC]
connect_bd_net [get_bd_pins reset_TDC] \
  [get_bd_pins BeltBus_TDL_Channel_1/reset_BB] [get_bd_pins BeltBus_TDL_Channel_1/reset_SYS] \
  [get_bd_pins BeltBus_TDL_Channel_1/reset_TDC] [get_bd_pins InputLogic_0/reset]
connect_bd_net -net write_debug_reg_0_1 [get_bd_pins write_debug_reg_0] [get_bd_pins TDCChannelSlice_1/write_debug_reg]
connect_bd_net [get_bd_pins xlconstant_2/dout] [get_bd_pins TDCChannelSlice_1/s00_axis_period_tvalid]
connect_bd_net -net xlslice_1_Dout [get_bd_pins write_reg] [get_bd_pins TDCChannelSlice_1/write_reg]

current_bd_instance /TDC_Calib/TDC/Ch2
connect_bd_intf_net [get_bd_intf_pins M00_BB] [get_bd_intf_pins BeltBus_TDL_Channel_2/M00_BB]
connect_bd_intf_net [get_bd_intf_pins M01_AXIS_DebugCT] [get_bd_intf_pins BeltBus_TDL_Channel_2/M01_AXIS_DebugCT]
connect_bd_intf_net [get_bd_intf_pins left_ch2_diff] [get_bd_intf_pins InputLogic_0/AsyncEventIn_Diff]
connect_bd_intf_net [get_bd_intf_pins S00_BB] [get_bd_intf_pins BeltBus_TDL_Channel_2/S00_BB]
connect_bd_net -net BeltBus_TDL_Channel_TDC_2_Calibrated [get_bd_pins BeltBus_TDL_Channel_2/Calibrated] \
  [get_bd_pins Calibrated] [get_bd_pins InputLogic_0/IsCalibrate] [get_bd_pins TDCChannelSlice_2/Calibrated]
connect_bd_net [get_bd_pins CalibEventIn] [get_bd_pins InputLogic_0/CalibEventIn]
connect_bd_net [get_bd_pins CoarseCounter_CTD] [get_bd_pins BeltBus_TDL_Channel_2/CoarseCounter_CTD]
connect_bd_net [get_bd_pins InputLogic_0/AsyncEventOut] [get_bd_pins BeltBus_TDL_Channel_2/AsyncInput]
connect_bd_net [get_bd_pins TDCChannelSlice_2/Divider] [get_bd_pins InputLogic_0/Divider]
connect_bd_net [get_bd_pins TDCChannelSlice_2/EdgeTrigger] [get_bd_pins InputLogic_0/EdgeTrigger]
connect_bd_net [get_bd_pins TDCChannelSlice_2/ForceCalibrate] [get_bd_pins InputLogic_0/ForceCalibrate]
connect_bd_net [get_bd_pins TDCChannelSlice_2/Gate] [get_bd_pins InputLogic_0/Gate]
connect_bd_net [get_bd_pins TDCChannelSlice_2/Restart_Calibration] [get_bd_pins BeltBus_TDL_Channel_2/Restart_Calibration]
connect_bd_net [get_bd_pins TDCChannelSlice_2/Stop_Calibration] [get_bd_pins BeltBus_TDL_Channel_2/Stop_Calibration]
connect_bd_net [get_bd_pins TDCChannelSlice_2/StretchLength] [get_bd_pins InputLogic_0/StretchLength]
connect_bd_net [get_bd_pins TDCChannelSlice_2/ValidNumberOfTdl] [get_bd_pins BeltBus_TDL_Channel_2/ValidNumberOfTDL]
connect_bd_net [get_bd_pins TDCChannelSlice_2/ValidPositionTap] [get_bd_pins BeltBus_TDL_Channel_2/ValidPositionTap]
connect_bd_net [get_bd_pins TDCChannelSlice_2/bitTrn_Cal_dout] [get_bd_pins BeltBus_TDL_Channel_2/bitTrn_Cal_dout]
connect_bd_net [get_bd_pins TDCChannelSlice_2/bitTrn_ReqSample] [get_bd_pins BeltBus_TDL_Channel_2/bitTrn_ReqSample]
connect_bd_net [get_bd_pins TDCChannelSlice_2/bitTrn_Uncal_addr] [get_bd_pins BeltBus_TDL_Channel_2/bitTrn_Uncal_addr]
connect_bd_net [get_bd_pins TDCChannelSlice_2/read_reg] [get_bd_pins read_reg]
connect_bd_net [get_bd_pins TDCChannelSlice_2/subInterpolationMatrix] [get_bd_pins BeltBus_TDL_Channel_2/subInterpolationMatrix]
connect_bd_net [get_bd_pins clk_BB] \
  [get_bd_pins BeltBus_TDL_Channel_2/clk_BB] [get_bd_pins BeltBus_TDL_Channel_2/clk_SYS] [get_bd_pins TDCChannelSlice_2/aclk] \
  [get_bd_pins TDCChannelSlice_2/clk_BB] [get_bd_pins TDCChannelSlice_2/clk_SYS]
connect_bd_net [get_bd_pins clk_TDC] \
  [get_bd_pins BeltBus_TDL_Channel_2/clk_TDC] [get_bd_pins InputLogic_0/clk] [get_bd_pins TDCChannelSlice_2/clk_TDC]
connect_bd_net [get_bd_pins reset_TDC] \
  [get_bd_pins BeltBus_TDL_Channel_2/reset_BB] [get_bd_pins BeltBus_TDL_Channel_2/reset_SYS] \
  [get_bd_pins BeltBus_TDL_Channel_2/reset_TDC] [get_bd_pins InputLogic_0/reset]
connect_bd_net -net write_debug_reg_0_1 [get_bd_pins write_debug_reg_0] [get_bd_pins TDCChannelSlice_2/write_debug_reg]
connect_bd_net [get_bd_pins xlconstant_2/dout] [get_bd_pins TDCChannelSlice_2/s00_axis_period_tvalid]
connect_bd_net -net xlslice_2_Dout [get_bd_pins write_reg] [get_bd_pins TDCChannelSlice_2/write_reg]

current_bd_instance /TDC_Calib/TDC/Sync
connect_bd_intf_net [get_bd_intf_pins AXI4Stream_PeriodMet_0/M00_AXIS] [get_bd_intf_pins axis_broadcaster_0/S_AXIS]
connect_bd_intf_net [get_bd_intf_pins TDCChannelSlice_0/S00_AXIS_Period] [get_bd_intf_pins axis_broadcaster_0/M01_AXIS]
connect_bd_intf_net [get_bd_intf_pins M00_BB] [get_bd_intf_pins BeltBus_TDL_Channel_0/M00_BB]
connect_bd_intf_net [get_bd_intf_pins M01_AXIS_DebugCT] [get_bd_intf_pins BeltBus_TDL_Channel_0/M01_AXIS_DebugCT]
connect_bd_intf_net [get_bd_intf_pins AXI4Stream_PeriodMet_0/S00_BB] [get_bd_intf_pins BeltBus_TDL_Channel_0/M00_AXIS]
connect_bd_intf_net [get_bd_intf_pins ch_sync_diff] [get_bd_intf_pins InputLogic_0/AsyncEventIn_Diff]
connect_bd_intf_net [get_bd_intf_pins M00_AXIS] [get_bd_intf_pins axis_broadcaster_0/M00_AXIS]
connect_bd_net -net BeltBus_TDL_Channel_TDC_0_Calibrated [get_bd_pins BeltBus_TDL_Channel_0/Calibrated] \
  [get_bd_pins Calibrated] [get_bd_pins InputLogic_0/IsCalibrate] [get_bd_pins TDCChannelSlice_0/Calibrated]
connect_bd_net [get_bd_pins CalibEventIn] [get_bd_pins InputLogic_0/CalibEventIn]
connect_bd_net [get_bd_pins CoarseCounter_CTD] [get_bd_pins BeltBus_TDL_Channel_0/CoarseCounter_CTD]
connect_bd_net [get_bd_pins InputLogic_0/AsyncEventOut] [get_bd_pins BeltBus_TDL_Channel_0/AsyncInput]
connect_bd_net [get_bd_pins TDCChannelSlice_0/Divider] [get_bd_pins InputLogic_0/Divider]
connect_bd_net [get_bd_pins TDCChannelSlice_0/EdgeTrigger] [get_bd_pins InputLogic_0/EdgeTrigger]
connect_bd_net [get_bd_pins TDCChannelSlice_0/ForceCalibrate] [get_bd_pins InputLogic_0/ForceCalibrate]
connect_bd_net [get_bd_pins TDCChannelSlice_0/Gate] [get_bd_pins InputLogic_0/Gate]
connect_bd_net [get_bd_pins TDCChannelSlice_0/Restart_Calibration] [get_bd_pins BeltBus_TDL_Channel_0/Restart_Calibration]
connect_bd_net [get_bd_pins TDCChannelSlice_0/Stop_Calibration] [get_bd_pins BeltBus_TDL_Channel_0/Stop_Calibration]
connect_bd_net [get_bd_pins TDCChannelSlice_0/StretchLength] [get_bd_pins InputLogic_0/StretchLength]
connect_bd_net [get_bd_pins TDCChannelSlice_0/ValidNumberOfTdl] [get_bd_pins BeltBus_TDL_Channel_0/ValidNumberOfTDL]
connect_bd_net [get_bd_pins TDCChannelSlice_0/ValidPositionTap] [get_bd_pins BeltBus_TDL_Channel_0/ValidPositionTap]
connect_bd_net [get_bd_pins TDCChannelSlice_0/bitTrn_Cal_dout] [get_bd_pins BeltBus_TDL_Channel_0/bitTrn_Cal_dout]
connect_bd_net [get_bd_pins TDCChannelSlice_0/bitTrn_ReqSample] [get_bd_pins BeltBus_TDL_Channel_0/bitTrn_ReqSample]
connect_bd_net [get_bd_pins TDCChannelSlice_0/bitTrn_Uncal_addr] [get_bd_pins BeltBus_TDL_Channel_0/bitTrn_Uncal_addr]
connect_bd_net [get_bd_pins TDCChannelSlice_0/read_reg] [get_bd_pins read_reg]
connect_bd_net [get_bd_pins TDCChannelSlice_0/subInterpolationMatrix] [get_bd_pins BeltBus_TDL_Channel_0/subInterpolationMatrix]
connect_bd_net [get_bd_pins clk_BB] \
  [get_bd_pins AXI4Stream_PeriodMet_0/clk] [get_bd_pins BeltBus_TDL_Channel_0/clk_BB] \
  [get_bd_pins BeltBus_TDL_Channel_0/clk_SYS] [get_bd_pins TDCChannelSlice_0/aclk] [get_bd_pins TDCChannelSlice_0/clk_BB] \
  [get_bd_pins TDCChannelSlice_0/clk_SYS] [get_bd_pins axis_broadcaster_0/aclk]
connect_bd_net [get_bd_pins clk_TDC] \
  [get_bd_pins BeltBus_TDL_Channel_0/clk_TDC] [get_bd_pins InputLogic_0/clk] [get_bd_pins TDCChannelSlice_0/clk_TDC]
connect_bd_net -net reset_0_1 [get_bd_pins reset_0] [get_bd_pins axis_broadcaster_0/aresetn] [get_bd_pins util_vector_logic_0/Op1]
connect_bd_net [get_bd_pins reset_TDC] \
  [get_bd_pins BeltBus_TDL_Channel_0/reset_BB] [get_bd_pins BeltBus_TDL_Channel_0/reset_SYS] \
  [get_bd_pins BeltBus_TDL_Channel_0/reset_TDC] [get_bd_pins InputLogic_0/reset]
connect_bd_net [get_bd_pins util_vector_logic_0/Res] [get_bd_pins AXI4Stream_PeriodMet_0/reset]
connect_bd_net -net write_debug_reg_0_1 [get_bd_pins write_debug_reg_0] [get_bd_pins TDCChannelSlice_0/write_debug_reg]
connect_bd_net -net xlslice_0_Dout [get_bd_pins write_reg] [get_bd_pins TDCChannelSlice_0/write_reg]

current_bd_instance /
connect_bd_intf_net [get_bd_intf_pins BeltBus_TDCHistogrammer_1/S00_BELT] [get_bd_intf_pins axis_broadcaster_0/M02_AXIS]
connect_bd_intf_net [get_bd_intf_pins BeltBus_TTM_0/S00_BB] [get_bd_intf_pins axis_broadcaster_0/M04_AXIS]
connect_bd_intf_net [get_bd_intf_pins MME_0/M_AXI_MM2S] [get_bd_intf_pins axi_interconnect_0/S00_AXI]
connect_bd_intf_net [get_bd_intf_pins AXI4Stream_UART_0/S00_AXIS_TX] [get_bd_intf_pins MME_0/M_AXIS]
connect_bd_intf_net [get_bd_intf_pins AXI4Stream_UART_0/M00_AXIS_RX] [get_bd_intf_pins MME_0/S_AXIS]
connect_bd_intf_net [get_bd_intf_pins MME_0/M_AXI_S2MM] [get_bd_intf_pins axi_interconnect_0/S01_AXI]
connect_bd_intf_net [get_bd_intf_pins BeltBus_TDCHistogrammer_1/M00_AXIS] [get_bd_intf_pins axis_interconnect_0/S02_AXIS]
connect_bd_intf_net [get_bd_intf_ports USB_UART] [get_bd_intf_pins AXI4Stream_UART_0/UART]
connect_bd_intf_net [get_bd_intf_pins BeltBus_TDCHistogrammer_0/S00_BELT] [get_bd_intf_pins axis_broadcaster_0/M01_AXIS]
connect_bd_intf_net [get_bd_intf_pins BeltBus_TTM_0/S00_AXI] [get_bd_intf_pins axi_interconnect_0/M08_AXI]
connect_bd_intf_net [get_bd_intf_pins BeltBus_TDCCounter_0/S00_BB] [get_bd_intf_pins axis_broadcaster_0/M00_AXIS]
connect_bd_intf_net [get_bd_intf_pins BeltBus_TDCCounter_0/M00_AXIS_Push] [get_bd_intf_pins axis_interconnect_0/S00_AXIS]
connect_bd_intf_net [get_bd_intf_pins TDC_Calib/S00_AXI] [get_bd_intf_pins axi_interconnect_0/M04_AXI]
connect_bd_intf_net [get_bd_intf_pins BeltBus_TDCHistogrammer_0/SYNC] [get_bd_intf_pins axis_broadcaster_1/M00_AXIS]
connect_bd_intf_net [get_bd_intf_pins BeltBus_TDCHistogrammer_1/SYNC] [get_bd_intf_pins axis_broadcaster_1/M01_AXIS]
connect_bd_intf_net [get_bd_intf_pins axi_interconnect_0/M07_AXI] [get_bd_intf_pins xadc_wiz_0/s_axi_lite]
connect_bd_intf_net [get_bd_intf_pins BeltBus_TTM_0/M00_AXIS] [get_bd_intf_pins MME_0/PTE_INPUT]
connect_bd_intf_net [get_bd_intf_pins BeltBus_TDCCounter_0/S00_AXI] [get_bd_intf_pins axi_interconnect_0/M01_AXI]
connect_bd_intf_net -intf_net TDC_M00_BB [get_bd_intf_pins TDC_Calib/M00_BB] [get_bd_intf_pins axis_broadcaster_0/S_AXIS]
connect_bd_intf_net [get_bd_intf_pins Master/S_AXI] [get_bd_intf_pins axi_interconnect_0/M00_AXI]
connect_bd_intf_net [get_bd_intf_pins TDC_Calib/M00_AXIS_Autopush] [get_bd_intf_pins axis_interconnect_0/S03_AXIS]
connect_bd_intf_net [get_bd_intf_pins TDC_Calib/M00_AXIS] [get_bd_intf_pins axis_broadcaster_1/S_AXIS]
connect_bd_intf_net [get_bd_intf_pins BeltBus_TDCHistogrammer_0/M00_AXIS] [get_bd_intf_pins axis_interconnect_0/S01_AXIS]
connect_bd_intf_net [get_bd_intf_pins BeltBus_TDCHistogrammer_0/S00_AXI] [get_bd_intf_pins axi_interconnect_0/M02_AXI]
connect_bd_intf_net [get_bd_intf_pins BeltBus_TDCHistogrammer_1/S00_AXI] [get_bd_intf_pins axi_interconnect_0/M03_AXI]
connect_bd_intf_net [get_bd_intf_pins MME_0/S_AXIS_AUX] [get_bd_intf_pins axis_interconnect_0/M00_AXIS]
connect_bd_intf_net [get_bd_intf_ports ch_sync_diff] [get_bd_intf_pins TDC_Calib/ch_sync_diff]
connect_bd_intf_net [get_bd_intf_ports left_ch1_diff] [get_bd_intf_pins TDC_Calib/left_ch1_diff]
connect_bd_intf_net [get_bd_intf_ports left_ch2_diff] [get_bd_intf_pins TDC_Calib/left_ch2_diff]
connect_bd_intf_net [get_bd_intf_ports sys_diff_clock] [get_bd_intf_pins clk_wiz_0/CLK_IN1_D]
connect_bd_intf_net [get_bd_intf_ports tdc_diff_clock] [get_bd_intf_pins TDC_Calib/tdc_diff_clock]
connect_bd_net [get_bd_pins clk_wiz_0/clk_out1] \
  [get_bd_pins AXI4Stream_UART_0/m00_axis_rx_aclk] [get_bd_pins AXI4Stream_UART_0/s00_axis_tx_aclk] \
  [get_bd_pins BeltBus_TDCCounter_0/s00_axi_aclk] [get_bd_pins BeltBus_TDCCounter_0/s00_bb_aclk] \
  [get_bd_pins BeltBus_TDCHistogrammer_0/m00_axis_aclk] [get_bd_pins BeltBus_TDCHistogrammer_0/s00_axi_aclk] \
  [get_bd_pins BeltBus_TDCHistogrammer_0/s00_belt_aclk] [get_bd_pins BeltBus_TDCHistogrammer_1/m00_axis_aclk] \
  [get_bd_pins BeltBus_TDCHistogrammer_1/s00_axi_aclk] [get_bd_pins BeltBus_TDCHistogrammer_1/s00_belt_aclk] \
  [get_bd_pins BeltBus_TTM_0/s00_axi_clk] [get_bd_pins BeltBus_TTM_0/s00_bb_clk] [get_bd_pins MME_0/clk] \
  [get_bd_pins Master/s_axi_aclk] [get_bd_pins TDC_Calib/clk_BB] [get_bd_pins axi_interconnect_0/ACLK] \
  [get_bd_pins axi_interconnect_0/M00_ACLK] [get_bd_pins axi_interconnect_0/M01_ACLK] \
  [get_bd_pins axi_interconnect_0/M02_ACLK] [get_bd_pins axi_interconnect_0/M03_ACLK] \
  [get_bd_pins axi_interconnect_0/M04_ACLK] [get_bd_pins axi_interconnect_0/M05_ACLK] \
  [get_bd_pins axi_interconnect_0/M06_ACLK] [get_bd_pins axi_interconnect_0/M07_ACLK] \
  [get_bd_pins axi_interconnect_0/M08_ACLK] [get_bd_pins axi_interconnect_0/S00_ACLK] \
  [get_bd_pins axi_interconnect_0/S01_ACLK] [get_bd_pins axis_broadcaster_0/aclk] [get_bd_pins axis_broadcaster_1/aclk] \
  [get_bd_pins axis_interconnect_0/ACLK] [get_bd_pins axis_interconnect_0/M00_AXIS_ACLK] \
  [get_bd_pins axis_interconnect_0/S00_AXIS_ACLK] [get_bd_pins axis_interconnect_0/S01_AXIS_ACLK] \
  [get_bd_pins axis_interconnect_0/S02_AXIS_ACLK] [get_bd_pins axis_interconnect_0/S03_AXIS_ACLK] \
  [get_bd_pins proc_sys_reset_0/slowest_sync_clk] [get_bd_pins xadc_wiz_0/s_axi_aclk]
connect_bd_net [get_bd_pins clk_wiz_0/clk_out2] [get_bd_pins AXI4Stream_UART_0/clk_uart]
connect_bd_net [get_bd_pins clk_wiz_0/locked] [get_bd_pins proc_sys_reset_0/dcm_locked]
connect_bd_net [get_bd_pins proc_sys_reset_0/interconnect_aresetn] \
  [get_bd_pins MME_0/interconnect_aresetn] [get_bd_pins axi_interconnect_0/ARESETN] [get_bd_pins axis_interconnect_0/ARESETN] \
  [get_bd_pins xadc_wiz_0/s_axi_aresetn]
connect_bd_net [get_bd_pins proc_sys_reset_0/peripheral_aresetn] \
  [get_bd_pins AXI4Stream_UART_0/m00_axis_rx_aresetn] [get_bd_pins AXI4Stream_UART_0/s00_axis_tx_aresetn] \
  [get_bd_pins BeltBus_TDCCounter_0/s00_axi_aresetn] [get_bd_pins BeltBus_TDCCounter_0/s00_bb_aresetn] \
  [get_bd_pins BeltBus_TDCHistogrammer_0/m00_axis_aresetn] [get_bd_pins BeltBus_TDCHistogrammer_0/s00_axi_aresetn] \
  [get_bd_pins BeltBus_TDCHistogrammer_0/s00_belt_aresetn] [get_bd_pins BeltBus_TDCHistogrammer_1/m00_axis_aresetn] \
  [get_bd_pins BeltBus_TDCHistogrammer_1/s00_axi_aresetn] [get_bd_pins BeltBus_TDCHistogrammer_1/s00_belt_aresetn] \
  [get_bd_pins BeltBus_TTM_0/s00_axi_aresetn] [get_bd_pins BeltBus_TTM_0/s00_bb_aresetn] \
  [get_bd_pins MME_0/peripherals_aresetn] [get_bd_pins Master/s_axi_aresetn] [get_bd_pins TDC_Calib/reset_0] \
  [get_bd_pins TDC_Calib/resetn] [get_bd_pins axi_interconnect_0/M00_ARESETN] [get_bd_pins axi_interconnect_0/M01_ARESETN] \
  [get_bd_pins axi_interconnect_0/M02_ARESETN] [get_bd_pins axi_interconnect_0/M03_ARESETN] \
  [get_bd_pins axi_interconnect_0/M04_ARESETN] [get_bd_pins axi_interconnect_0/M05_ARESETN] \
  [get_bd_pins axi_interconnect_0/M06_ARESETN] [get_bd_pins axi_interconnect_0/M07_ARESETN] \
  [get_bd_pins axi_interconnect_0/M08_ARESETN] [get_bd_pins axi_interconnect_0/S00_ARESETN] \
  [get_bd_pins axi_interconnect_0/S01_ARESETN] [get_bd_pins axis_broadcaster_0/aresetn] \
  [get_bd_pins axis_broadcaster_1/aresetn] [get_bd_pins axis_interconnect_0/M00_AXIS_ARESETN] \
  [get_bd_pins axis_interconnect_0/S00_AXIS_ARESETN] [get_bd_pins axis_interconnect_0/S01_AXIS_ARESETN] \
  [get_bd_pins axis_interconnect_0/S02_AXIS_ARESETN] [get_bd_pins axis_interconnect_0/S03_AXIS_ARESETN]
connect_bd_net [get_bd_pins proc_sys_reset_0/peripheral_reset] [get_bd_pins TDC_Calib/reset]
connect_bd_net [get_bd_pins xlconstant_0/dout] [get_bd_pins AXI4Stream_UART_0/rst]
connect_bd_net [get_bd_pins xlconstant_1/dout] [get_bd_pins proc_sys_reset_0/ext_reset_in]

# ---- address map ----
assign_bd_address -offset 0x00000000 -range 4K -target_address_space [get_bd_addr_spaces MME_0/M_AXI_MM2S] [get_bd_addr_segs Master/axi_bram_ctrl_0/S_AXI/Mem0]
assign_bd_address -offset 0x44A00000 -range 64K -target_address_space [get_bd_addr_spaces MME_0/M_AXI_MM2S] [get_bd_addr_segs BeltBus_TDCCounter_0/S00_AXI/MAIN]
assign_bd_address -offset 0x44A10000 -range 64K -target_address_space [get_bd_addr_spaces MME_0/M_AXI_MM2S] [get_bd_addr_segs BeltBus_TDCHistogrammer_0/S00_AXI/reg0]
assign_bd_address -offset 0x44A20000 -range 64K -target_address_space [get_bd_addr_spaces MME_0/M_AXI_MM2S] [get_bd_addr_segs BeltBus_TDCHistogrammer_1/S00_AXI/reg0]
assign_bd_address -offset 0x44A40000 -range 64K -target_address_space [get_bd_addr_spaces MME_0/M_AXI_MM2S] [get_bd_addr_segs TDC_Calib/AXI4_TDC_Wrapper_0/S00_AXI/reg0]
assign_bd_address -offset 0x44A50000 -range 64K -target_address_space [get_bd_addr_spaces MME_0/M_AXI_MM2S] [get_bd_addr_segs xadc_wiz_0/s_axi_lite/Reg]
assign_bd_address -offset 0x44A60000 -range 64K -target_address_space [get_bd_addr_spaces MME_0/M_AXI_MM2S] [get_bd_addr_segs BeltBus_TTM_0/S00_AXI/reg0]
assign_bd_address -offset 0x00000000 -range 4K -target_address_space [get_bd_addr_spaces MME_0/M_AXI_S2MM] [get_bd_addr_segs Master/axi_bram_ctrl_0/S_AXI/Mem0]
assign_bd_address -offset 0x44A00000 -range 64K -target_address_space [get_bd_addr_spaces MME_0/M_AXI_S2MM] [get_bd_addr_segs BeltBus_TDCCounter_0/S00_AXI/MAIN]
assign_bd_address -offset 0x44A10000 -range 64K -target_address_space [get_bd_addr_spaces MME_0/M_AXI_S2MM] [get_bd_addr_segs BeltBus_TDCHistogrammer_0/S00_AXI/reg0]
assign_bd_address -offset 0x44A20000 -range 64K -target_address_space [get_bd_addr_spaces MME_0/M_AXI_S2MM] [get_bd_addr_segs BeltBus_TDCHistogrammer_1/S00_AXI/reg0]
assign_bd_address -offset 0x44A40000 -range 64K -target_address_space [get_bd_addr_spaces MME_0/M_AXI_S2MM] [get_bd_addr_segs TDC_Calib/AXI4_TDC_Wrapper_0/S00_AXI/reg0]
assign_bd_address -offset 0x44A50000 -range 64K -target_address_space [get_bd_addr_spaces MME_0/M_AXI_S2MM] [get_bd_addr_segs xadc_wiz_0/s_axi_lite/Reg]
assign_bd_address -offset 0x44A60000 -range 64K -target_address_space [get_bd_addr_spaces MME_0/M_AXI_S2MM] [get_bd_addr_segs BeltBus_TTM_0/S00_AXI/reg0]

validate_bd_design
save_bd_design
